# Altium schematic sheet Connectors.SchDoc: Triumvi - Sensing - Connectors
size Letter; Author: Ye-Sheng Kuo; Revision: 9; SheetNumber: 6; SheetTotal: 6
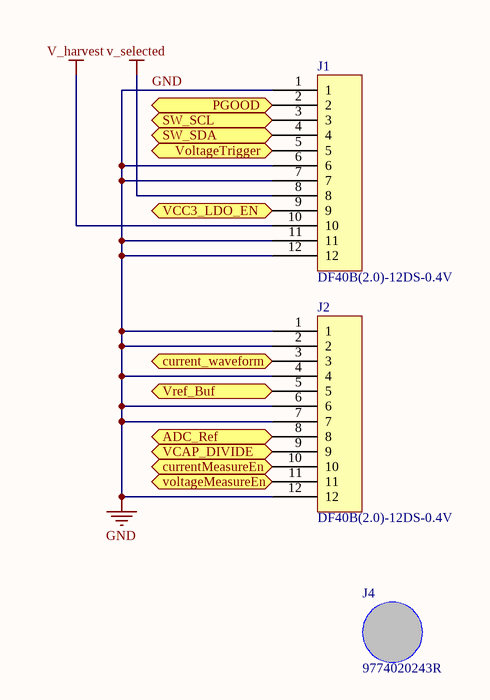
[diagram p0: Connectors.SchDoc]

## Parts
J1  DF40B(2.0)-12DS-0.4V  [DF40B(2.0)-12DS-0.4V]
J2  DF40B(2.0)-12DS-0.4V  [DF40B(2.0)-12DS-0.4V]
J4  9774020243R  [9774020243R]

## Ports
ADC_Ref, current_waveform, currentMeasureEn, PGOOD, SW_SCL, SW_SDA, VCAP_DIVIDE, VCC3_LDO_EN, voltageMeasureEn, VoltageTrigger, Vref_Buf

## Nets
GND: J1.1 J1.6 J1.7 J1.11 J1.12 J2.1 J2.2 J2.4 J2.6 J2.7 J2.12
V_harvest: J1.10
v_selected: J1.8
ADC_Ref: J2.8 ; port ADC_Ref
current_waveform: J2.3 ; port current_waveform
currentMeasureEn: J2.10 ; port currentMeasureEn
PGOOD: J1.2 ; port PGOOD
SW_SCL: J1.3 ; port SW_SCL
SW_SDA: J1.4 ; port SW_SDA
VCAP_DIVIDE: J2.9 ; port VCAP_DIVIDE
VCC3_LDO_EN: J1.9 ; port VCC3_LDO_EN
voltageMeasureEn: J2.11 ; port voltageMeasureEn
VoltageTrigger: J1.5 ; port VoltageTrigger
Vref_Buf: J2.5 ; port Vref_Buf

## Notes on the sheet
- Title
- Date:
- Author:
- Revision:
- Sheet
- of
- University of Michigan
- File:

## Library data of the parts
J1 J2 = DF40B(2.0)-12DS-0.4V: Hirose BM20 Series, 0.4mm pitch, 2mm stack height, 12 pos, header; Supplier 1: Digi-Key; Supplier Part Number 1: H124594CT-ND
J4 = 9774020243R: 2 mm stack height, m2 standoff; Supplier 1: Digi-Key; Supplier Part Number 1: 732-7073-1-ND